# Altium project Light_Music_PCB_Project.PrjPCB
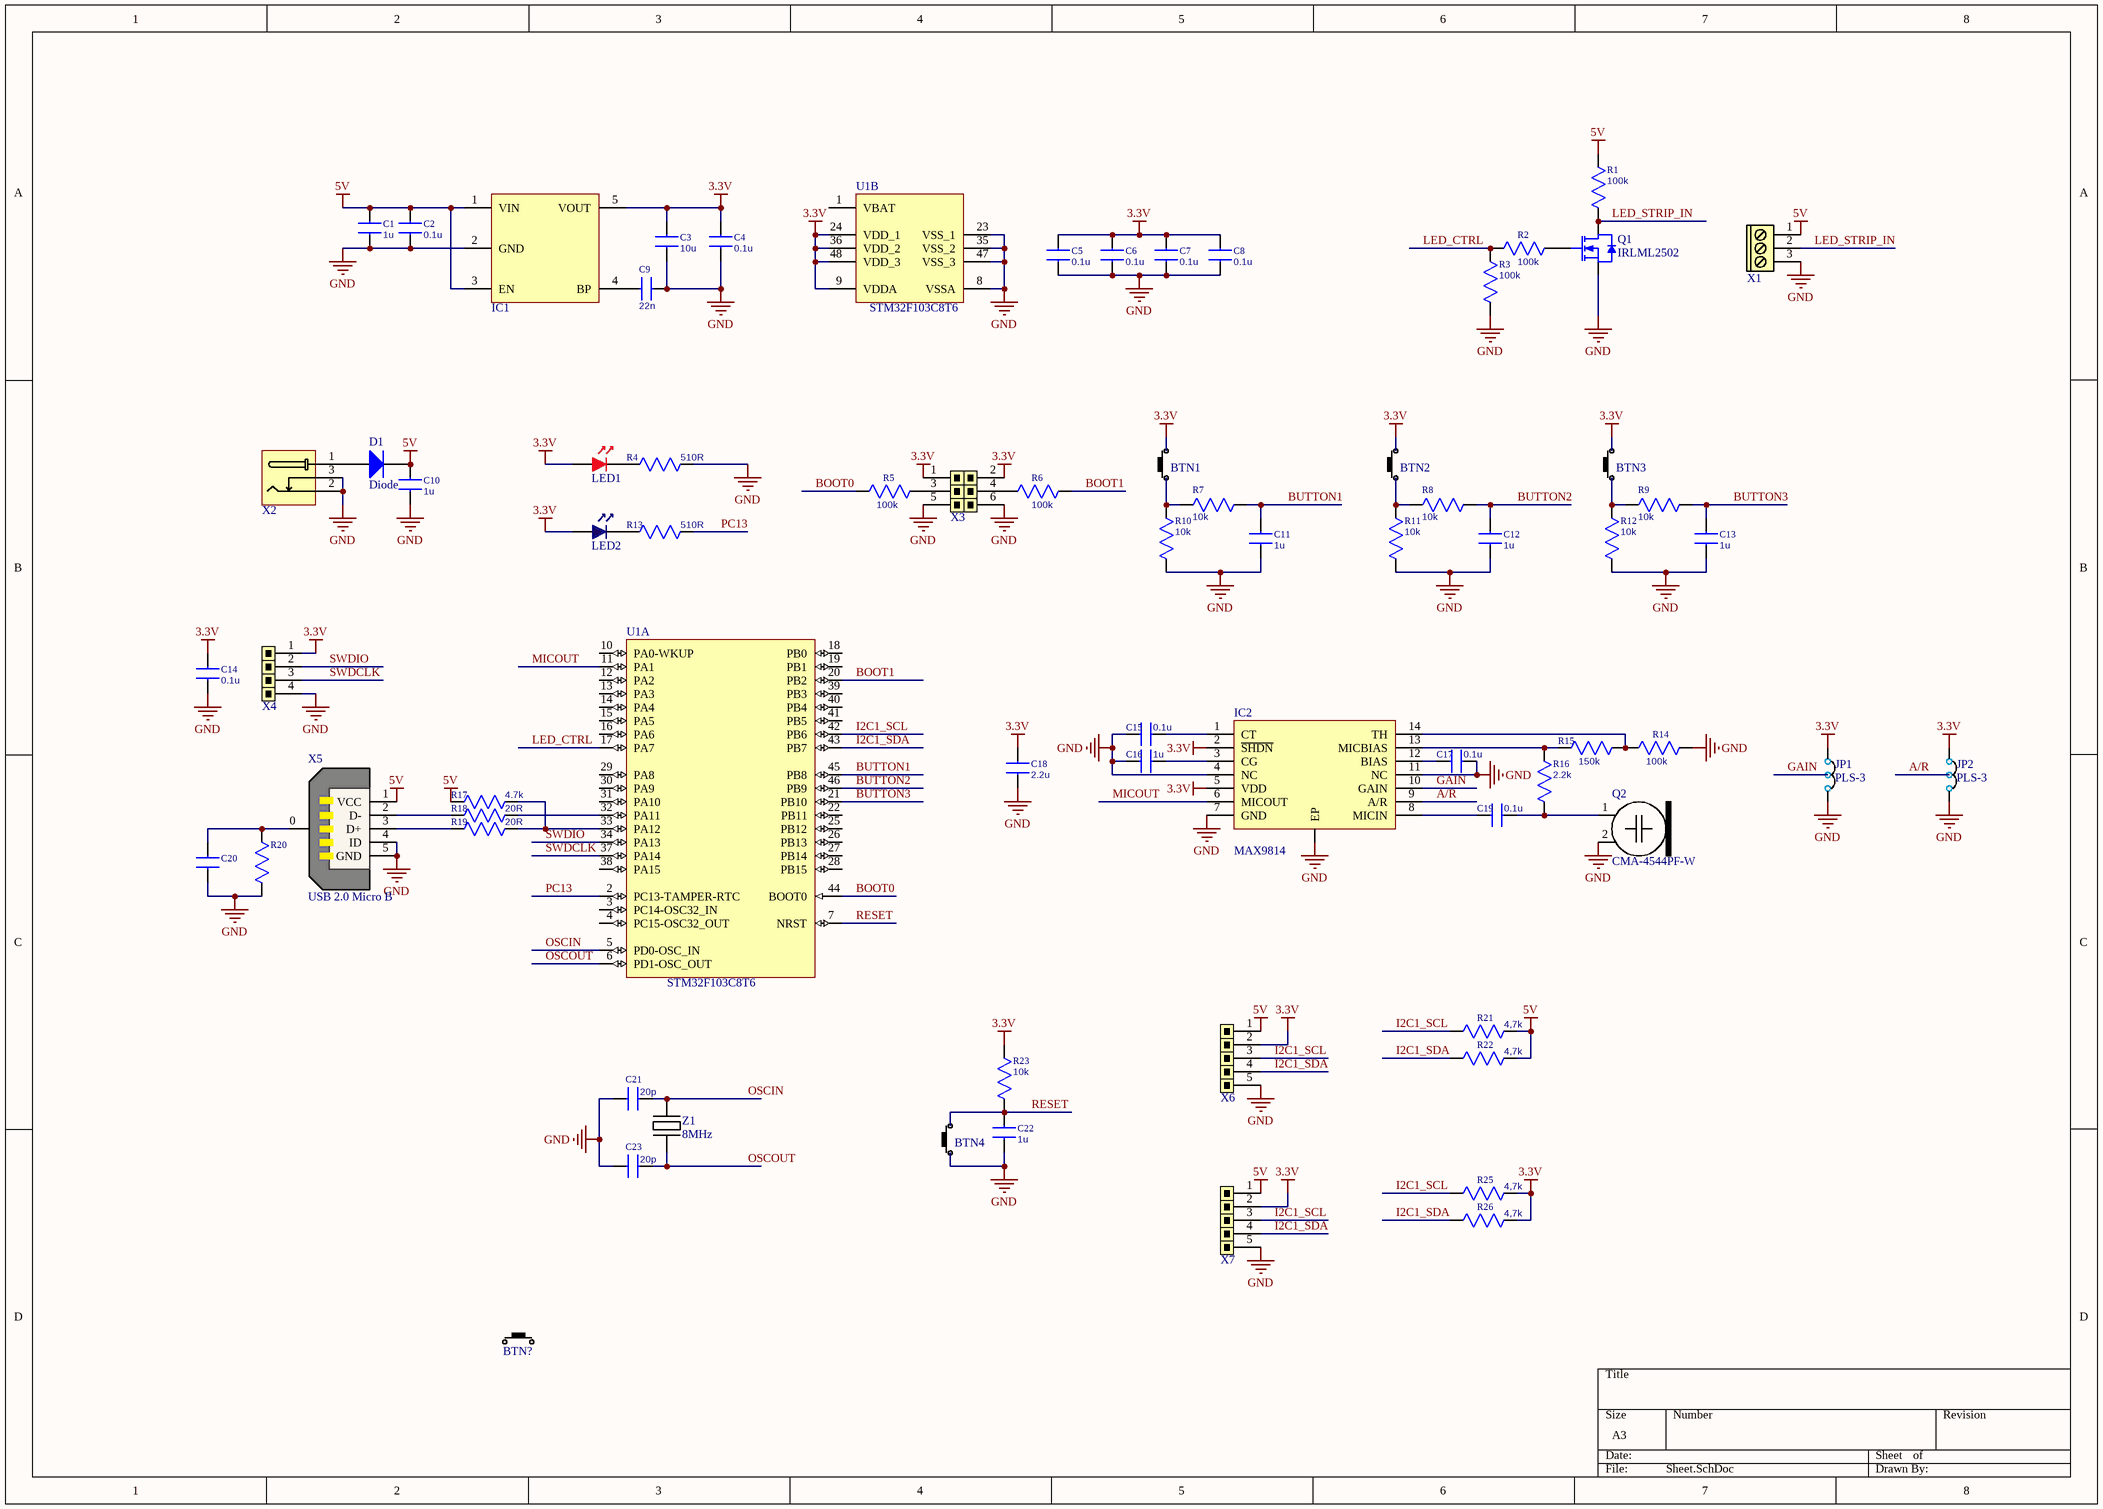
[diagram p0: Sheet.SchDoc]
1 sheet, 71 parts. Net scope: global (net labels, ports and power ports of the same name join across sheets).
Board file: PCB.PcbDoc

## Sheet Sheet.SchDoc
size A3

### Parts
BTN1  Push Button  [PUSH BUTTON]  (value not drawn)
BTN2  Push Button  [PUSH BUTTON]  (value not drawn)
BTN3  Push Button  [PUSH BUTTON]  (value not drawn)
BTN4  Push Button  [PUSH BUTTON]  (value not drawn)
BTN?  Push Button  [PUSH BUTTON RIGHT ANGLE]  (value not drawn)
C1  1u  [C_0805]
C2  0.1u  [C_0603]
C3  10u  [C_0805]
C4  0.1u  [C_0603]
C5  0.1u  [C_0603]
C6  0.1u  [C_0603]
C7  0.1u  [C_0603]
C8  0.1u  [C_0603]
C9  22n  [C_0603]
C10  1u  [C_0805]
C11  1u  [C_0603]
C12  1u  [C_0603]
C13  1u  [C_0603]
C14  0.1u  [C_0603]
C15  0.1u  [C_0603]
C16  1u  [C_0805]
C17  0.1u  [C_0603]
C18  2.2u  [C_0805]
C19  0.1u  [C_0603]
C20  10n  [C_0603]  (value not drawn)
C21  20p  [C_0603]
C22  1u  [C_0603]
C23  20p  [C_0603]
D1  Diode  [SMC]
IC1  RT9193  [SOT23]  (value not drawn)
IC2  MAX9814  [TDFN-14]
JP1  PLS-3  [PLS-3]
JP2  PLS-3  [PLS-3]
LED1  LED Red  [LED 0603 RED]  (value not drawn)
LED2  LED Blue  [LED 0603 BLUE]  (value not drawn)
Q1  IRLML2502  [SOT23]
Q2  CMA-4544PF-W  [CMA-4544PF-W]
R1  100k  [R_0603]
R2  100k  [R_0603]
R3  100k  [R_0603]
R4  510R  [R_0603]
R5  100k  [R_0603]
R6  100k  [R_0603]
R7  10k  [R_0603]
R8  10k  [R_0603]
R9  10k  [R_0603]
R10  10k  [R_0603]
R11  10k  [R_0603]
R12  10k  [R_0603]
R13  510R  [R_0603]
R14  100k  [R_0603]
R15  150k  [R_0603]
R16  2.2k  [R_0603]
R17  4.7k  [R_0603]
R18  20R  [R_0603]
R19  20R  [R_0603]
R20  100k  [R_0603]  (value not drawn)
R21  4,7k  [R_0603]
R22  4,7k  [R_0603]
R23  10k  [R_0603]
R25  4,7k  [R_0603]
R26  4,7k  [R_0603]
U1  STM32F103C8T6  [STM-LQFP48_L]  (parts A,B of 2)
X1  DG-300-3  [DG-300-5MM-3]  (value not drawn)
X2  Jack Female  [DC-140]  (value not drawn)
X3  PLD-6  [PLD-6]  (value not drawn)
X4  PLS-4  [PLS-4]  (value not drawn)
X5  USB 2.0 Micro B  [USB 2.0 MICRO B]
X6  PLS-5  [PLS-5]  (value not drawn)
X7  PLS-5  [PLS-5]  (value not drawn)
Z1  8MHz  [HC-49]

### Nets
3.3V: BTN1.2 BTN2.2 BTN3.2 C3.2 C4.1 C5.1 C6.1 C7.1 C8.1 C14.1 C18.1 IC1.5(VOUT) IC2.2(~{SHDN}) IC2.5(VDD) JP1.1 JP2.1 LED1.A LED2.A R23.1 R25.1 R26.1 U1.9(VDDA) U1.24(VDD_1) U1.36(VDD_2) U1.48(VDD_3) X3.1 X3.2 X4.1 X6.2 X7.2
5V: C1.2 C2.2 C10.2 D1.2(K) IC1.1(VIN) IC1.3(EN) R1.1 R17.1 R21.1 R22.1 X1.1 X5.1(VCC) X6.1 X7.1
GND: BTN4.1 C1.1 C2.1 C3.1 C4.2 C5.2 C6.2 C7.2 C8.2 C9.2 C10.1 C11.1 C12.1 C13.1 C14.2 C15.2 C16.2 C17.1 C18.2 C20.1 C21.1 C22.1 C23.1 IC1.2(GND) IC2.0(EP) IC2.4(NC) IC2.7(GND) IC2.11(NC) JP1.3 JP2.3 Q1.2(S) Q2.2 R3.2 R4.1 R10.1 R11.1 R12.1 R14.2 R20.2 U1.8(VSSA) U1.23(VSS_1) U1.35(VSS_2) U1.47(VSS_3) X1.3 X2.2 X2.3 X3.5 X3.6 X4.4 X5.4(ID) X5.5(GND) X6.5 X7.5
A/R: IC2.9(A/R) JP2.2
BOOT0: R5.2 U1.44(BOOT0)
BOOT1: R6.1 U1.20(PB2)
BUTTON1: C11.2 R7.2 U1.45(PB8)
BUTTON2: C12.2 R8.2 U1.46(PB9)
BUTTON3: C13.2 R9.2 U1.21(PB10)
GAIN: IC2.10(GAIN) JP1.2
I2C1_SCL: R21.2 R25.2 U1.42(PB6) X6.3 X7.3
I2C1_SDA: R22.2 R26.2 U1.43(PB7) X6.4 X7.4
LED_CTRL: R2.2 R3.1 U1.17(PA7)
LED_STRIP_IN: Q1.3(D) R1.2 X1.2
MICOUT: IC2.6(MICOUT) U1.11(PA1)
OSCIN: C21.2 U1.5(PD0-OSC_IN) Z1.2
OSCOUT: C23.2 U1.6(PD1-OSC_OUT) Z1.1
PC13: R13.1 U1.2(PC13-TAMPER-RTC)
RESET: BTN4.2 C22.2 R23.2 U1.7(NRST)
SWDCLK: U1.37(PA14) X4.3
SWDIO: U1.34(PA13) X4.2
NetBTN1_1: BTN1.1 R7.1 R10.2
NetBTN2_1: BTN2.1 R8.1 R11.2
NetBTN3_1: BTN3.1 R9.1 R12.2
NetC9_1: C9.1 IC1.4(BP)
NetC15_1: C15.1 IC2.1(CT)
NetC16_1: C16.1 IC2.3(CG)
NetC17_2: C17.2 IC2.12(BIAS)
NetC19_1: C19.1 Q2.1 R16.1
NetC19_2: C19.2 IC2.8(MICIN)
NetC20_2: C20.2 R20.1 X5.0
NetD1_1: D1.1(A) X2.1
NetIC2_13: IC2.13(MICBIAS) R15.1 R16.2
NetIC2_14: IC2.14(TH) R14.1 R15.2
NetLED1_C: LED1.C R4.2
NetLED2_C: LED2.C R13.2
NetQ1_1: Q1.1(G) R2.1
NetR5_1: R5.1 X3.3
NetR6_2: R6.2 X3.4
NetR17_2: R17.2 R19.1 U1.33(PA12)
NetR18_1: R18.1 U1.32(PA11)
NetR18_2: R18.2 X5.2(D-)
NetR19_2: R19.2 X5.3(D+)

Not connected (* = marked no-connect by the designer): BTN? 1 2; U1 1(VBAT) 3(PC14-OSC32_IN) 4(PC15-OSC32_OUT) 10(PA0-WKUP) 12(PA2) 13(PA3) 14(PA4) 15(PA5) 16(PA6) 18(PB0) 19(PB1) 22(PB11) 25(PB12) 26(PB13) 27(PB14) 28(PB15) 29(PA8) 30(PA9) 31(PA10) 38(PA15) 39(PB3) 40(PB4) 41(PB5)

### Library data of the parts
C1 C3 C10 C16 C18 = C0805: Capacitor
  C1 C10 C16: Value: 1u
  C3: Value: 10u
  C18: Value: 2.2u
C2 C4-C9 C11-C15 C17 C19-C23 = C0603: Capacitor
  C2 C4-C8 C14 C15 C17 C19: Value: 0.1u
  C9: Value: 22n
  C11-C13 C22: Value: 1u
  C20: Value: 10n
  C21 C23: Value: 20p
D1 = Diode: Default Diode; Published: 8-Jun-2000; LatestRevisionDate: 17-Jul-2002; LatestRevisionNote: Re-released for DXP Platform.; PackageVersion: Sep-1996; PackageReference: SMC; Publisher: Altium Limited; PackageDescription: DO-214-AB/SMC; 2 C-Bend Leads; Body 7.9 x 5.9 mm, inc. leads (LxW); Code_JEDEC: DO-214-AB
IC1 = RT9193: 300mA, CMOS LDO Regulator
IC2 = MAX9814: Microphone Amplifier with AGC and  Low-Noise Microphone Bias
JP1 JP2 = JP-3: Jumper Pins; Type: PLS-3
Q1 = N-ch_SOT23: N-Channel Enhancement Mode MOSFET; Published: 17-Dec-2003; DatasheetVersion: May-99; PackageVersion: 1996; PackageReference: SOT23; Publisher: Altium Limited; PackageDescription: SOT-23; 3 Leads; Body 3.1 x 2.5 mm, inc. leads (LxW max), Alternate Lead Configuration; ComponentLink1Description: Manufacturer Link; ComponentLink1URL: http://www.zetex.com/; ComponentLink2Description: Datasheet; ComponentLink2URL: www.zetex.com/3.0/pdf/ZXM61N02F.pdf
Q2 = CMA-4544PF-W: Electret condenser microphone
R1-R23 R25 R26 = R0603: Resistor
  R1-R3 R5 R6 R14 R20: Value: 100k
  R4 R13: Value: 510R
  R7-R12 R23: Value: 10k
  R15: Value: 150k
  R16: Value: 2.2k
  R17: Value: 4.7k
  R18 R19: Value: 20R
  R21 R22 R25 R26: Value: 4,7k
U1 = STM32F103C8T6: ARM Cortex-M3 32-bit MCU, 64 KB Flash, 20 KB Internal RAM, 37 I/Os, 48-pin LQFP, -40 to 85 degC, Tray; A/D Converter: 2x12-bit (10 Channel); FLASH Size (Prog) (kB): 64; I/Os (High Current): 37; Internal RAM Size (kB): 20; Operating Frequency(F) (Processor speed) (MHz): 72; Supply Voltage(Vcc) min (V): 2; DatasheetVersion: Rev. 16; PackageVersion: Rev. 6, 06/2013; PackageReference: LQFP48; PackageDescription: 48-Pin Low Profile Quad Flat Package, 7 x 7 mm Body, 0.5 mm Pitch; Supplier 1: Digi-Key; Supplier Part Number 1: 497-6063-ND; Supplier 2: Farnell; Supplier Part Number 2: 1447637; Supplier 3: Newark; Supplier Part Number 3: 59M2182; Supplier 4: Newark; Supplier Part Number 4: 57P1222; Supplier 5: Mouser; Supplier Part Number 5: 511-STM32F103C8T6; Core: ARM Cortex-M3; Packing: Tray; Mounting Technology: Surface Mount; PartNumber: STM32F103C8T6; ComponentLink1Description: Manufacturer URL; ComponentLink1URL: http://www.st.com/web/en/home.html; ComponentLink2Description: Datasheet; ComponentLink2URL: http://www.st.com/st-web-ui/static/active/en/resource/technical/document/datasheet/CD00161566.pdf; ComponentLink3Description: Package Specification; ComponentLink3URL: http://www.st.com/st-web-ui/static/active/en/resource/technical/document/datasheet/DM00058181.pdf
Z1 = XTAL: Quartz resonator